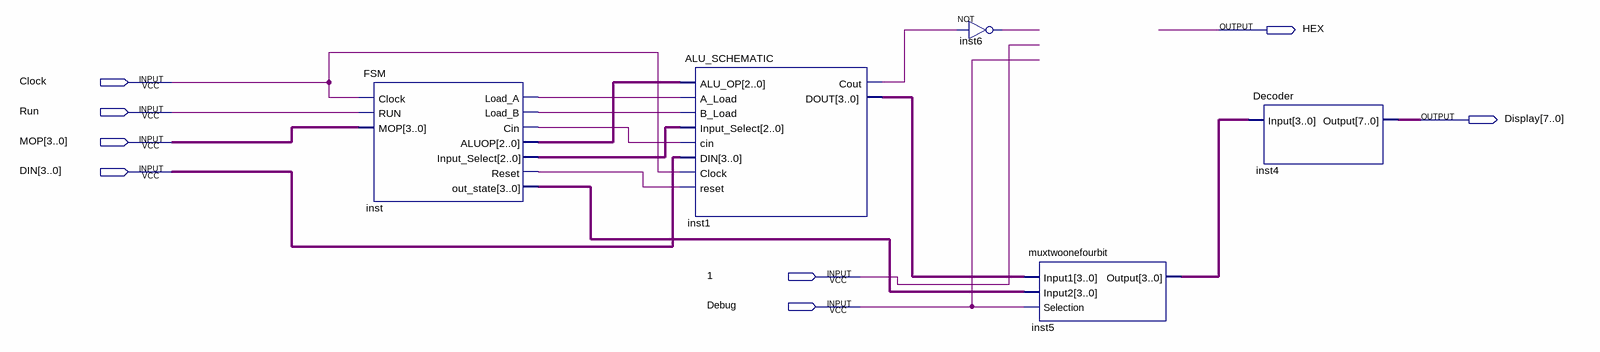
[diagram p0: schematic sheet]
// Quartus schematic Zafer_Attal.bdf as structural Verilog: 5 symbols, 8 pins
module Zafer_Attal (
  input  Clock,
  input  Run,
  input  [3:0] MOP,
  input  [3:0] DIN,
  input  \1 ,
  input  Debug,
  output HEX,
  output [7:0] Display
);

  wire inst1_cout, inst6_out, inst_cin, inst_load_a, inst_load_b, inst_reset;
  wire [2:0] inst_aluop, inst_input_select;
  wire [3:0] inst1_dout, inst5_output, inst_out_state;

  FSM inst (
    .Clock(Clock), .RUN(Run), .MOP(MOP), .Load_A(inst_load_a), .Load_B(inst_load_b), .Cin(inst_cin),
    .ALUOP(inst_aluop), .Input_Select(inst_input_select), .Reset(inst_reset), .out_state(inst_out_state));
  ALU_SCHEMATIC inst1 (
    .ALU_OP(inst_aluop), .A_Load(inst_load_a), .B_Load(inst_load_b), .Input_Select(inst_input_select),
    .cin(inst_cin), .DIN(DIN), .Clock(Clock), .reset(inst_reset), .Cout(inst1_cout), .DOUT(inst1_dout));
  not inst6 (inst6_out, inst1_cout);
  muxtwoonefourbit inst5 (.Input1(inst1_dout), .Input2(inst_out_state), .Selection(Debug), .Output(inst5_output));
  Decoder inst4 (.Input(inst5_output), .Output(Display));
endmodule
